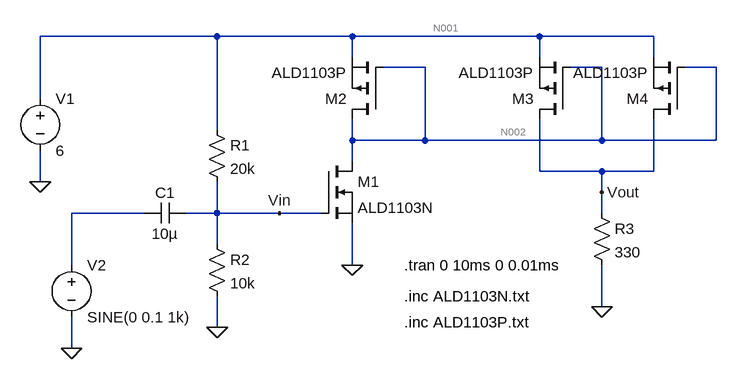
[diagram p0: schematic exp1.asc]
exp1.asc, the LTspice schematic file:
Version 4.1
SHEET 1 1088 680
WIRE 304 -16 32 -16
WIRE 512 -16 304 -16
WIRE 800 -16 512 -16
WIRE 976 -16 800 -16
WIRE 512 16 512 -16
WIRE 800 16 800 -16
WIRE 976 16 976 -16
WIRE 624 32 560 32
WIRE 896 32 848 32
WIRE 1072 32 1024 32
WIRE 32 80 32 -16
WIRE 304 128 304 -16
WIRE 512 144 512 112
WIRE 624 144 624 32
WIRE 624 144 512 144
WIRE 896 144 896 32
WIRE 896 144 624 144
WIRE 1072 144 1072 32
WIRE 1072 144 896 144
WIRE 512 176 512 144
WIRE 800 192 800 112
WIRE 896 192 800 192
WIRE 976 192 976 112
WIRE 976 192 896 192
WIRE 32 208 32 160
WIRE 896 224 896 192
WIRE 192 256 80 256
WIRE 304 256 304 208
WIRE 304 256 256 256
WIRE 400 256 304 256
WIRE 464 256 400 256
WIRE 896 256 896 224
WIRE 304 304 304 256
WIRE 80 336 80 256
WIRE 512 336 512 272
WIRE 896 400 896 336
WIRE 304 432 304 384
WIRE 80 464 80 416
FLAG 32 208 0
FLAG 80 464 0
FLAG 304 432 0
FLAG 512 336 0
FLAG 896 400 0
FLAG 896 224 Vout
FLAG 400 256 Vin
SYMBOL voltage 32 64 R0
WINDOW 123 0 0 Left 0
WINDOW 39 0 0 Left 0
SYMATTR InstName V1
SYMATTR Value 6
SYMBOL res 288 112 R0
SYMATTR InstName R1
SYMATTR Value 20k
SYMBOL res 288 288 R0
SYMATTR InstName R2
SYMATTR Value 10k
SYMBOL cap 256 240 R90
WINDOW 0 0 32 VBottom 2
WINDOW 3 32 32 VTop 2
SYMATTR InstName C1
SYMATTR Value 10µ
SYMBOL voltage 80 320 R0
WINDOW 123 0 0 Left 0
WINDOW 39 0 0 Left 0
SYMATTR InstName V2
SYMATTR Value SINE(0 0.1 1k)
SYMBOL nmos 464 176 R0
SYMATTR InstName M1
SYMATTR Value ALD1103N
SYMBOL pmos 560 112 R180
SYMATTR InstName M2
SYMATTR Value ALD1103P
SYMBOL pmos 848 112 R180
SYMATTR InstName M3
SYMATTR Value ALD1103P
SYMBOL pmos 1024 112 R180
SYMATTR InstName M4
SYMATTR Value ALD1103P
SYMBOL res 880 240 R0
SYMATTR InstName R3
SYMATTR Value 330
TEXT 592 384 Left 2 !.inc ALD1103N.txt
TEXT 592 424 Left 2 !.inc ALD1103P.txt
TEXT 592 336 Left 2 !.tran 0 10ms 0 0.01ms

The netlist it stands for:
* exp1.asc
V1 N001 0 6
R1 N001 Vin 20k
R2 Vin 0 10k
C1 Vin N003 10µ
V2 N003 0 SINE(0 0.1 1k)
M1 N002 Vin 0 0 ALD1103N
M2 N002 N002 N001 N001 ALD1103P
M3 Vout N002 N001 N001 ALD1103P
M4 Vout N002 N001 N001 ALD1103P
R3 Vout 0 330
.model NMOS NMOS
.model PMOS PMOS
.lib standard.mos
.inc ALD1103N.txt
.inc ALD1103P.txt
.tran 0 10ms 0 0.01ms
.backanno
.end

* Results of the author's LTspice run, read from the files saved beside the schematic
* Operating Point, zero values left out:
*   V(vin) = 2 V
*   V(n002) = 3.225 V
*   V(vout) = 3.945 V
*   V(n001) = 6 V
*   I(V1) = -18.16 mA
*   I(R2) = 200 µA
*   Id(M1) = 6 mA
*   Is(M1) = -6 mA
*   Ib(M1) = -3.237 pA
*   Id(M3) = -5.978 mA
*   Is(M3) = 5.978 mA
*   Ib(M3) = 2.066 pA
*   Id(M4) = -5.978 mA
*   Is(M4) = 5.978 mA
*   Ib(M4) = 2.066 pA
*   I(R3) = 11.96 mA
*   I(R1) = 200 µA
*   Id(M2) = -6 mA
*   Is(M2) = 6 mA
*   Ib(M2) = 2.786 pA
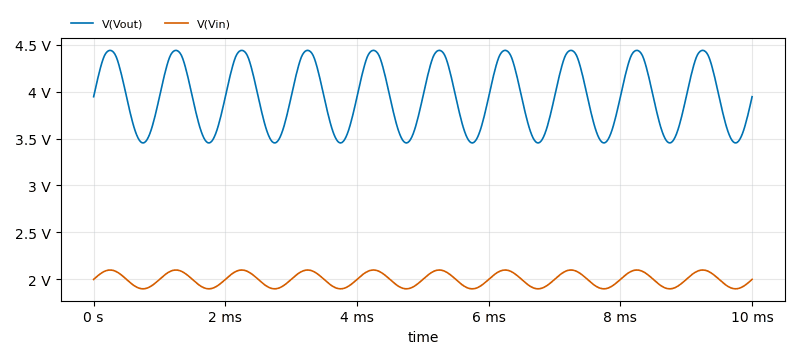
[diagram p1: Transient Analysis of exp1.asc, plotted from the saved traces]
* Transient Analysis, 1 run:
*   V(Vout): min 3.453 V, max 4.439 V, average 3.948 V, rms 3.964 V, last 3.946 V
*   V(Vin): min 1.9 V, max 2.1 V, average 2 V, rms 2.001 V, last 2 V